# Altium schematic sheet LPCOSensor3vValve.SchDoc
size B; SheetNumber: 1; SheetTotal: 1
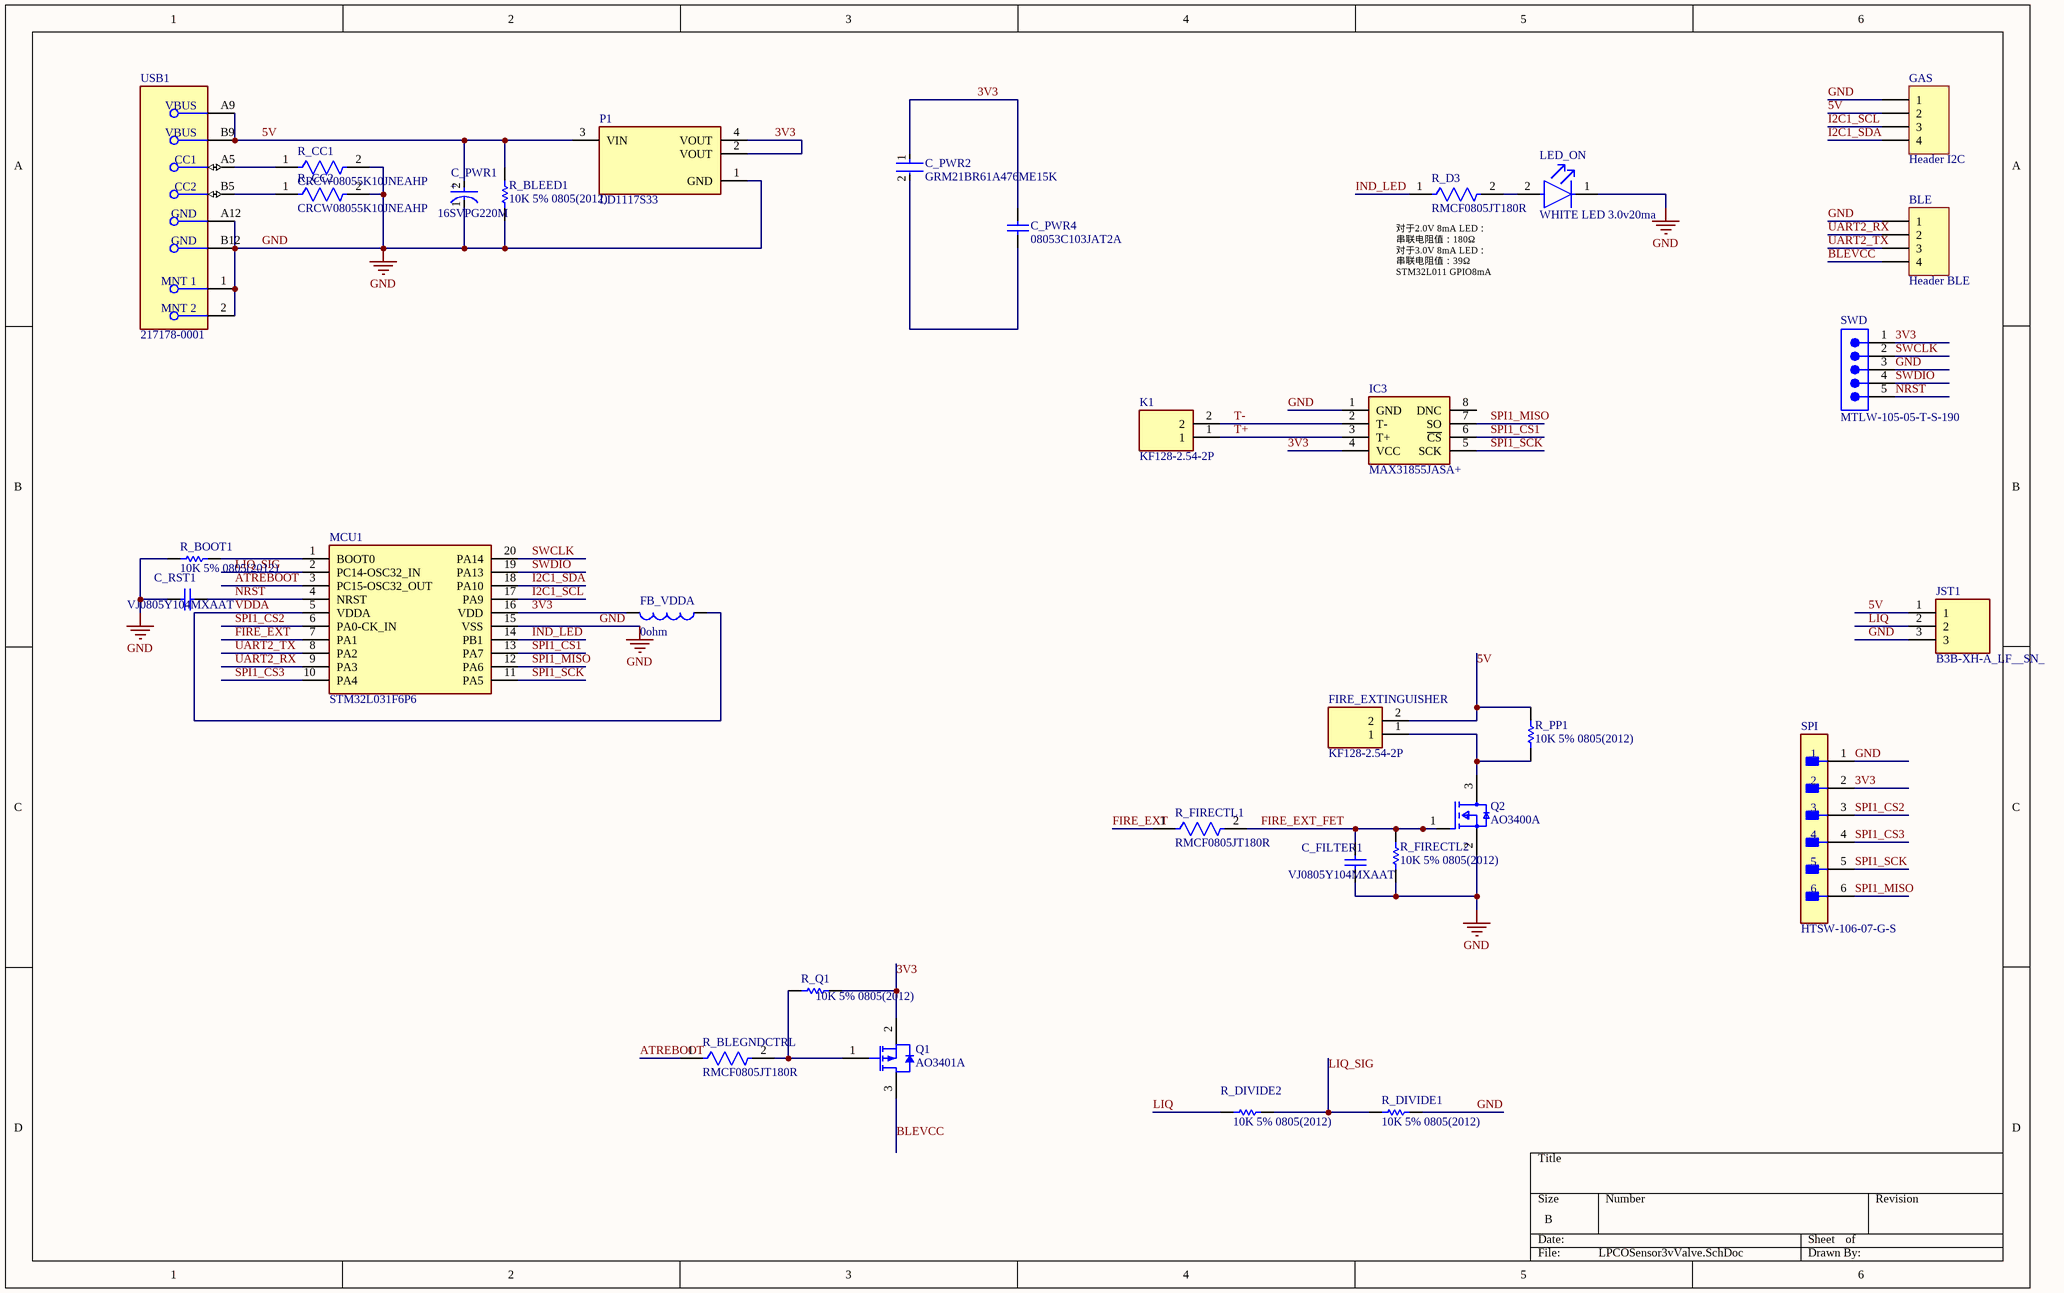
[diagram p0: LPCOSensor3vValve.SchDoc]

## Parts
BLE  Header BLE  [HDR1X4]
C_FILTER1  VJ0805Y104MXAAT  [CAPC2013X145X48NL20T23]
C_PWR1  16SVPG220M  [FP-OS-CON-SMT-C6-MFG]
C_PWR2  GRM21BR61A476ME15K  [FP-GRM21B-0_2-e0_2_0_7-IPC_C]
C_PWR4  08053C103JAT2A  [CAPC2013X94X50LL20T25]
C_RST1  VJ0805Y104MXAAT  [CAPC2013X145X48NL20T23]
FB_VDDA  0ohm  [WE-CBF_0805_L2W1.2H0.9_HC]
FIRE_EXTINGUISHER  KF128-2.54-2P  [KF1282542P]
GAS  Header I2C  [HDR1X4]
IC3  MAX31855JASA+  [SOIC127P600X175-8N]
JST1  B3B-XH-A_LF__SN_  [B3BXHALFSN]
K1  KF128-2.54-2P  [KF1282542P]
LED_ON  WHITE LED 3.0v20ma  [FP-SML-LX0805UWC-TR-MFG]
MCU1  STM32L031F6P6  [SOP65P640X120-20N]
P1  LD1117S33  [FP-SOT-223-0046067_14-MFG]
Q1  AO3401A  [AO-SOT-23-3L_V]
Q2  AO3400A  [FP-SOT23-MFG]
R_BLEED1  10K 5% 0805(2012)  [RESC0805(2012)_L]
R_BLEGNDCTRL  RMCF0805JT180R  [FP-RMCF0805-IPC_B]
R_BOOT1  10K 5% 0805(2012)  [RESC0805(2012)_L]
R_CC1  CRCW08055K10JNEAHP  [FP-CRCW0805-HPe3-MFG]
R_CC2  CRCW08055K10JNEAHP  [FP-CRCW0805-HPe3-MFG]
R_D3  RMCF0805JT180R  [FP-RMCF0805-IPC_B]
R_DIVIDE1  10K 5% 0805(2012)  [RESC0805(2012)_L]
R_DIVIDE2  10K 5% 0805(2012)  [RESC0805(2012)_L]
R_FIRECTL1  RMCF0805JT180R  [FP-RMCF0805-IPC_B]
R_FIRECTL2  10K 5% 0805(2012)  [RESC0805(2012)_L]
R_PP1  10K 5% 0805(2012)  [RESC0805(2012)_L]
R_Q1  10K 5% 0805(2012)  [RESC0805(2012)_L]
SPI  HTSW-106-07-G-S  [FP-HTSW-106-07-G-S-MFG]
SWD  MTLW-105-05-T-S-190  [SMTC-MTLW-105-05-X-S-190]
USB1  217178-0001  [FP-217178-0001-MFG]

## Nets
GND: BLE.1 C_FILTER1.1 C_PWR1.1(C) C_RST1.1 GAS.1 IC3.1(GND) JST1.3 LED_ON.1(C) MCU1.15(VSS) P1.1(GND) Q2.2(S) R_BLEED1.2 R_BOOT1.2 R_CC1.2 R_CC2.2 R_DIVIDE1.1 R_FIRECTL2.1 SPI.1 SWD.3 USB1.1(MNT_1) USB1.2(MNT_2) USB1.A12(GND) USB1.B12(GND)
3V3: C_PWR2.1 C_PWR4.2 FB_VDDA.2 IC3.4(VCC) MCU1.16(VDD) P1.2(VOUT) P1.4(VOUT) Q1.2(SOURCE) R_Q1.1 SPI.2 SWD.1
5V: C_PWR1.2(A) FIRE_EXTINGUISHER.2 GAS.2 JST1.1 P1.3(VIN) R_BLEED1.1 R_PP1.1 USB1.A9(VBUS) USB1.B9(VBUS)
ATREBOOT: MCU1.3(PC15-OSC32_OUT) R_BLEGNDCTRL.1
BLEVCC: BLE.4 Q1.3(DRAIN)
FIRE_EXT: MCU1.7(PA1) R_FIRECTL1.1
FIRE_EXT_FET: C_FILTER1.2 Q2.1(G) R_FIRECTL1.2 R_FIRECTL2.2
I2C1_SCL: GAS.3 MCU1.17(PA9)
I2C1_SDA: GAS.4 MCU1.18(PA10)
IND_LED: MCU1.14(PB1) R_D3.1
LIQ: JST1.2 R_DIVIDE2.2
LIQ_SIG: MCU1.2(PC14-OSC32_IN) R_DIVIDE1.2 R_DIVIDE2.1
NRST: C_RST1.2 MCU1.4(NRST) SWD.5
SPI1_CS1: IC3.6(~{CS}) MCU1.13(PA7)
SPI1_CS2: MCU1.6(PA0-CK_IN) SPI.3
SPI1_CS3: MCU1.10(PA4) SPI.4
SPI1_MISO: IC3.7(SO) MCU1.12(PA6) SPI.6
SPI1_SCK: IC3.5(SCK) MCU1.11(PA5) SPI.5
SWCLK: MCU1.20(PA14) SWD.2
SWDIO: MCU1.19(PA13) SWD.4
T+: IC3.3(T+) K1.1
T-: IC3.2(T-) K1.2
UART2_RX: BLE.2 MCU1.9(PA3)
UART2_TX: BLE.3 MCU1.8(PA2)
VDDA: FB_VDDA.1 MCU1.5(VDDA)
NetC_PWR2_2: C_PWR2.2 C_PWR4.1
NetFIRE_EXTINGUISHER_1: FIRE_EXTINGUISHER.1 Q2.3(D) R_PP1.2
NetLED_ON_2: LED_ON.2(A) R_D3.2
NetMCU1_1: MCU1.1(BOOT0) R_BOOT1.1
NetQ1_1: Q1.1(GATE) R_BLEGNDCTRL.2 R_Q1.2
NetR_CC1_1: R_CC1.1 USB1.A5(CC1)
NetR_CC2_1: R_CC2.1 USB1.B5(CC2)

Not connected (* = marked no-connect by the designer): IC3 8(DNC)

## Notes on the sheet
- 对于2.0V 8mA LED：
  串联电阻值：180Ω
  对于3.0V 8mA LED：
  串联电阻值：39Ω
  STM32L011 GPIO8mA
- (in symbol CMP-05428-000859-1) +

## Library data of the parts
BLE GAS = Header 4: Header, 4-Pin; LatestRevisionDate: 17-Jul-2002; LatestRevisionNote: Re-released for DXP Platform.; Publisher: Altium Limited
C_FILTER1 C_RST1 = CMP-2007-01733-1: Manufacturer: Vitramon; Part Number: VJ0805Y104MXAAT
C_PWR1 = CMP-05428-000859-1: Conductive Polymer Aluminum Solid Capacitors (OS-CON) 220uF ±20% 16V
C_PWR2 = CMP-06035-042633-1: Chip Multilayer Ceramic Capacitors for General Purpose, 0805, 47uF, X5R, 15%, 20%, 10V; Min Operating Temperature: -55°C; Max Operating Temperature: 85°C; Length: 0.079inch; Case Code (Imperial): 0805; Tolerance: 20%; Mount: Surface Mount; Voltage Rating (DC): 10V; Termination: SMD/SMT; Voltage Rating: 10V; Weight: 0.000335oz; Package Quantity: 10000; Dielectric: X5R; Thickness: 0.057inch; Capacitance: 47uF; Case/Package: 0805; Width: 0.049inch; Case Code (Metric): 2012; Packaging: Tape and Reel
C_PWR4 = CMP-2007-04234-1: Manufacturer: AVX Interconnect / Elco; Part Number: 08053C103JAT2A
FB_VDDA = CMP-0220-00029-2: NexarPartId: 7861696; Resistance: 50mΩ; Number of Lines: 1; Tolerance: 25%; Test Frequency: 100MHz; Max Current Rating: 2A; Inductance: 5.6H; Impedance: 220Ω; RoHS: Compliant; Max Operating Temperature: 125°C; Case Code (Metric): 2012; Depth: 1.2mm; Case Code (Imperial): 0805; REACH SVHC: Unknown; Min Operating Temperature: -55°C; Core Material: Ferrite; Length: 2mm; Case/Package: SMD/SMT; Termination: SMD/SMT; Packaging: Digi-Reel®; Height: 900µm; Lead Free: Lead Free; Weight: 10.999615mg; Current Rating: 2A; Max DC Current: 2A; Width: 1.2mm; DC Resistance (DCR): 50mΩ; Mount: Surface Mount; Material: Ferrite
FIRE_EXTINGUISHER K1 = KF128-2.54-2P: Connector; Manufacturer_Name: CIXI KEFA ELECTRONICS; Datasheet Link: https://jirorwxhqiillo5p.ldycdn.com/KF128-2.54-aidqpBpqKirRliSqmrqirlki.pdf; Height: 9.1mm; Manufacturer_Part_Number: KF128-2.54-2P
IC3 = MAX31855JASA+: Integrated Circuit; Manufacturer_Name: Analog Devices; Datasheet Link: https://datasheets.maximintegrated.com/en/ds/MAX31855.pdf; Height: 1.75mm; Manufacturer_Part_Number: MAX31855JASA+; Mouser Part Number: 700-MAX31855JASA+; Mouser Price/Stock: https://www.mouser.co.uk/ProductDetail/Analog-Devices-Maxim-Integrated/MAX31855JASA%2b?qs=4Rc5iGDDRGgfomCSqMwnEw%3D%3D; Arrow Part Number: MAX31855JASA+; Arrow Price/Stock: https://www.arrow.com/en/products/max31855jasa/analog-devices?utm_currency=USD&region=nac
JST1 = B3B-XH-A_LF__SN_: Connector; Manufacturer_Name: JST (JAPAN SOLDERLESS TERMINALS); Manufacturer_Part_Number: B3B-XH-A(LF)(SN); Datasheet Link: https://datasheet.lcsc.com/szlcsc/1812131720_JST-Sales-America-B3B-XH-A-LF-SN_C144394.pdf; Height: 7mm; Mouser Part Number: 306-B3BXHALFSNP; Mouser Price/Stock: https://www.mouser.co.uk/ProductDetail/JST-Commercial/B3B-XH-ALFSN?qs=cdbOS8ANM9BVkoboCCIEMQ%3D%3D; Arrow Part Number: B3B-XH-A(LF)(SN); Arrow Price/Stock: https://www.arrow.com/en/products/b3b-xh-a-lf-sn_1/jst-manufacturing.html?utm_currency=USD&region=europe
LED_ON = CMP-00229-00139794-1: SML-LX0805UWC-TR White LED, 0805 Diffused, Rectangle Lens SMD package; NexarPartId: 139794; Approvals: CSA, UL; Lens Color: Clear, Yellow; Luminous Intensity: 150mcd; Power Rating: 120mW; Forward Current: 20mA; Forward Voltage: 3.5V; Number of LEDs: 1; Viewing Angle: 120°; RoHS: Compliant; Case/Package: 0805; Illumination Color: White; Min Operating Temperature: -40°C; Mount: Surface Mount; Max Operating Temperature: 85°C
MCU1 = STM32L031F6P6: Integrated Circuit; Manufacturer_Name: STMicroelectronics; Datasheet Link: https://www.st.com/resource/en/datasheet/stm32l031g4.pdf; Height: 1.2mm; Manufacturer_Part_Number: STM32L031F6P6; Mouser Part Number: 511-STM32L031F6P6; Mouser Price/Stock: https://www.mouser.co.uk/ProductDetail/STMicroelectronics/STM32L031F6P6?qs=dTJS0cRn7ohDt6e1EJh76Q%3D%3D; Arrow Part Number: STM32L031F6P6; Arrow Price/Stock: https://www.arrow.com/en/products/stm32l031f6p6/stmicroelectronics?utm_currency=USD&region=nac
P1 = CMP-0244-00307-2: IC REG LINEAR 3.3V 800MA SOT223; Input Bias Current: 5mA; Output Voltage Accuracy: 1%; Dropout Voltage: 1.1V; Power Dissipation: 12W; Polarity: Positive; Min Input Voltage: 5.3V; Quiescent Current: 10mA; Max Output Current: 1.3A; Output Current: 950mA; Number of Regulators: 1; Max Supply Voltage: 15V; Output Type: Fixed; Output Voltage: 3.3V; Number of Terminals: 4; Min Supply Voltage: 3.3V; Termination: SMD/SMT; Mount: Surface Mount; Max Power Dissipation: 12W; Case/Package: SOT-223; Lead Free: Lead Free; Height: 1.8mm; REACH SVHC: No SVHC; Radiation Hardening: No; Width: 3.5mm; Length: 6.5mm; Packaging: Tape and Reel; Max Input Voltage: 15V; Accuracy: 1%; Weight: 0.01lb; Contact Plating: Tin; Max Operating Temperature: 125°C; Number of Pins: 4; Max Output Voltage: 3.3V; Min Operating Temperature: -40°C; Nominal Output Voltage: 3.3V; Package Quantity: 1; Min Output Voltage: 3.3V; Number of Outputs: 1
Q1 = CMP-2000-05778-1: P-Channel MOSFET, 30 V, 4 A, -55 to 150 degC, 3-Pin SOT-23-3L, RoHS, Tape and Reel; Manufacturer: Alpha and Omega; Output Power (Max): NotRequiredW; Power Dissipation: 1.4W; Rad Hardened: No; Drain Efficiency: NotRequired%; Drain-Source On-Volt: 30V; Noise Figure: NotRequireddB; Frequency (Max): NotRequiredMHz; Number of  Elements: 1; Gate-Source Voltage (Max): ?12V; Drain Current (Max): 4A; Channel Mode: Enhancement; Drain-Source On-Res: 0.044ohm; Type: PowerMOSFET; Polarity: P; Package URL: http://www.aosmd.com/res/packaging_information/SOT-23-3L.pdf; Datasheet URL: http://www.aosmd.com/res/data_sheets/AO3401A.pdf; Package Type: SOT-23; Package Description: 3-Pin Small Outline Transistor, Body 2.95 x 1.6 mm, Pitch 0.95 mm; Mounting: SurfaceMount; Manufacturer URL: http://www.aosmd.com/; Continuous Drain Current: 4A; Package Reference: SOT-23-3L; Mounting Technology: SurfaceMount; Operating Temperature Classification: Military; Power Gain: NotRequireddB; Datasheet Version: Rev. 3, 03/2011; Operating Temp Range: -55Cto150C; Pin Count: 3
Q2 = CMP-83955-000006-1: MOSFET N-CH 30V 5.7A SOT23; Input Capacitance: 630pF; Number of Elements: 1; Rds On Max: 26.5mR; Max Power Dissipation: 1.4W; Gate to Source Voltage (Vgs): 12V; Min Operating Temperature: -55°C; Lead Free: Lead Free; Number of Pins: 3; Drain to Source Voltage (Vdss): 30V; Case/Package: SOT-23; Mount: Surface Mount; Continuous Drain Current (ID): 5.7A; Radiation Hardening: No; Packaging: Tape and Reel; Max Operating Temperature: 150°C; Power Dissipation: 1.4W
R_BLEED1 R_BOOT1 R_DIVIDE1 R_DIVIDE2 R_FIRECTL2 R_PP1 R_Q1 = CMP-1013-00098-1: 10K 0.125W 5% 0805 (2012 Metric)  SMD; Case-EIA: 0805; Case-Metric: 2012; Value: 10000.00 Ohm; Power: 0.125 W; Technology: SMT; Tolerance: 5 %
R_BLEGNDCTRL R_D3 R_FIRECTL1 = CMP-26527-003283-1: 180Ω ±5% 0.125W 0805 Thick Film Chip Resistor AEC-Q200 compliant; Max Power Dissipation: 125mW; Temperature Coefficient: 200ppm/°C; Resistance: 180R; Case Code (Imperial): 0805; Height: 0.026inch; Case Code (Metric): 2012; Length: 0.079inch; Series: RMCF; Lead Free: Lead Free; Number of Terminations: 2; Military Standard: Not; Packaging: Tape and Reel; Case/Package: 0805; Mount: Surface Mount; Resistor Type: Thick Film; Radiation Hardening: No; Features: Automotive AEC-Q200; Construction: Rectangular; Tolerance: 5%; Contact Plating: Tin; RoHS Compliant: Yes; Min Operating Temperature: -55°C; Depth: 1.25mm; Max Operating Temperature: 155°C; Width: 0.049inch
R_CC1 R_CC2 = CMP-02407-002962-1: RES Thick Film, 5.1kΩ, 5%, 0.5W, 200ppm/°C, 0805; Resistance: 5.1kR; Max Power Dissipation: 500mW; Packaging: Tape and Reel; Max Operating Temperature: 155°C; Min Operating Temperature: -55°C; Tolerance: 5%; Temperature Coefficient: 200ppm/°C; Case/Package: 0805; Package Quantity: 5000; Height: 0.024inch; Features: Automotive AEC-Q200; Width: 0.049inch; Length: 0.079inch; Lead Free: Lead Free; Composition: Thick Film; Number of Terminations: 2
SPI = CMP-02766-001515-1: CONN HEADER VERT 6POS 2.54MM; Number of Positions: 6; Pitch: 0.1inch; Max Voltage Rating (AC): 550V; Gender: Male; Max Current Rating: 7.6A; Contact Type: Male Pin; Contact Finish - Mating: GOLD; REACH SVHC: No SVHC; Number of Rows: 1; Insulation Material: Polymer; Housing Color: Natural; Connector Type: Header; Termination: Solder; Flammability Rating: UL94 V-0; Mount: Through Hole; Contact Shape: Square; Fastening Type: Pull; Max Operating Temperature: 125°C; Contact Material: Bronze; RoHS Compliant: Yes; Series: HTSW; Min Operating Temperature: -55°C; Contact Mating Length: 0.23inch; Orientation: Straight; Number of Contacts: 6; Depth: 2.48mm; Housing Material: Polymer; Insulation Color: Natural; Lead Free: Lead Free; Radiation Hardening: No; Length: 15.24mm; Contact Plating: Gold; Color: Natural; Packaging: Rail/Tube
SWD = CMP-1024-00077-1: Low Profile .025" SQ Post Header, Through-hole, Vertical, -55 to 105 degC, 2.54 mm Pitch, 5-Pin, Male, RoHS; Manufacturer: Samtec; Pitch: 2.54 mm; RoHS: True; Temperature Range: -55 to 105 degC; Orientation: Vertical; ComponentLink1Description: Manufacturer URL; DatasheetVersion: F-214; ComponentLink3URL: http://www.samtec.com/documents/webfiles/cpdf/MTLW-1XX-XX-XX-X-XXX-XX-XX-MKT1.pdf; ComponentLink2URL: http://www.samtec.com/documents/webfiles/pdf/MTLW_TH.PDF; Mounting Technology: Through-hole; ComponentLink1URL: http://www.samtec.com; ComponentLink2Description: Datasheet; PartNumber: MTLW-105-05-T-S-190; ComponentLink3Description: Package Specification; PackageVersion: T, 6/1991; PackageReference: MTLW-105-05-X-S-190; PackageDescription: Low Profile Terminal Assembly
USB1 = CMP-04767-000032-1: CONN RCPT USB2.0 TYP C 24POS SMD